# EAGLE design TIA2_1ch (EAGLE 7.5.0)
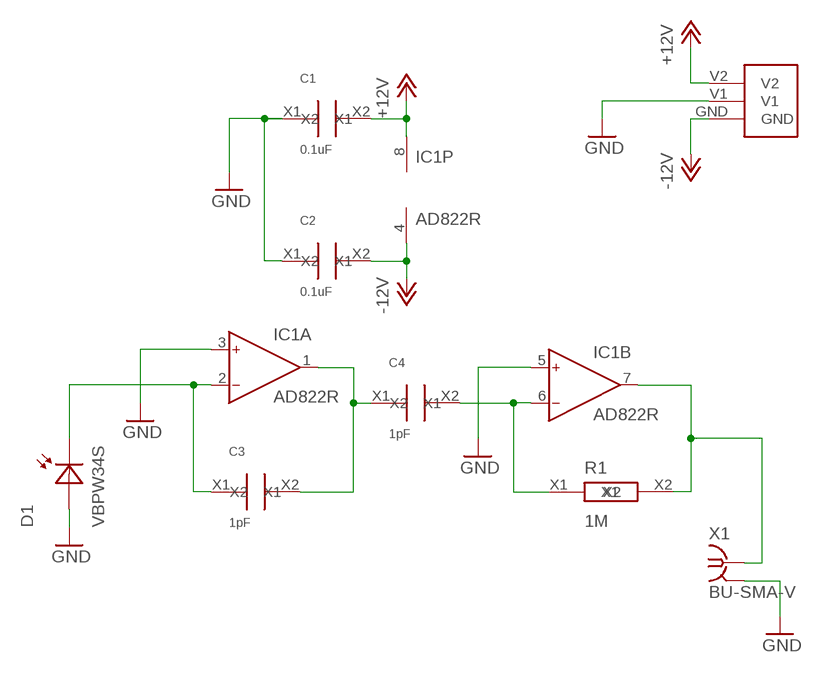
[diagram p0: schematic, sheet 1]

## Parts
C1  0.1uF  C_SMD_2.1X1.25  [SMD_2.1X1.25]
C2  0.1uF  C_SMD_2.1X1.25  [SMD_2.1X1.25]
C3  1pF  C_SMD_2.1X1.25  [SMD_2.1X1.25]
C4  1pF  C_SMD_2.1X1.25  [SMD_2.1X1.25]
D1  VBPW34S  [SOD6439X130N]
IC1  AD822R  [SO8]
R1  1M  R_SMD_2.1X1.25  [SMD_2.1X1.25]
U$1  BAT3_PLUG  [BAT3_PLUG]
X1  BU-SMA-V  [BU-SMA-V]

## Nets
+12V: C1.X2 IC1.8(P:V+) U$1.V2
-12V: C2.X2 IC1.4(P:V-) U$1.GND
GND: C1.X1 C2.X1 D1.A IC1.3(A:IN+) IC1.5(B:IN+) U$1.V1 X1.2 X1.3 X1.4 X1.5
N$1: C3.X1 D1.C IC1.2(A:IN-)
N$2: C3.X2 C4.X1 IC1.1(A:OUT)
N$3: C4.X2 IC1.6(B:IN-) R1.X1
N$4: IC1.7(B:OUT) R1.X2 X1.1

## Library data of the parts
C1-C4 = MyPowerComponents:C_SMD_2.1X1.25
D1 = VBPW34S:VBPW34S: VBPW34SR Series 60 V 940 nm 50 mA 215 mW Surface Mount Silicon PIN Photodiode; DESCRIPTION: VBPW34SR Series 60 V 940 nm 50 mA 215 mW Surface Mount Silicon PIN Photodiode; DIGI-KEY_PART_NUMBER: 751-1500-1-ND; DIGI-KEY_PURCHASE_URL: https://www.digikey.ru/product-detail/en/vishay-semiconductor-opto-division/VBPW34S/751-1500-1-ND/2354866?utm_source=snapeda&utm_medium=aggregator&utm_campaign=symbol; MF: Vishay; MP: VBPW34S; PACKAGE: SMD-2 Vishay
IC1 = analog-devices:AD822: Single-Supply, Rail-to-Rail Low Power FET-Input Op Amp Source: http://www.analog.com/static/imported-files/data_sheets/AD822.pdf; MF: ANALOG DEVICES; MPN: AD822BRZ; OC_FARNELL: 1651303
R1 = MyPowerComponents:R_SMD_2.1X1.25
U$1 = MyDuino:BAT3_PLUG
X1 = con-coax:BU-SMA-V: FEMALE SMA CONNECTOR Radiall distributor RS 112-3794; OC_FARNELL: unknown; OC_NEWARK: unknown

## Board
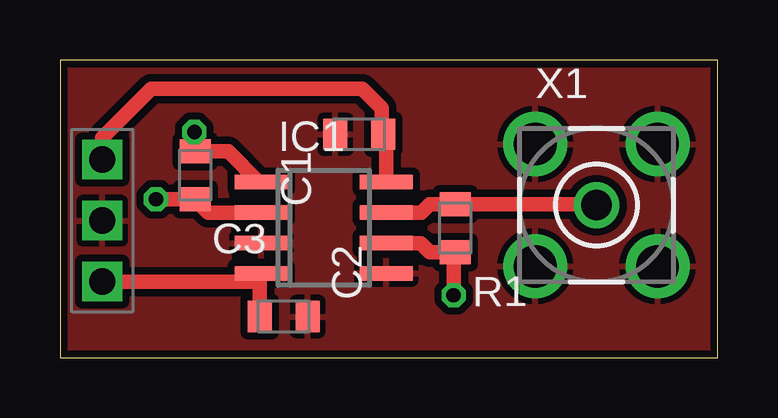
[diagram p1: board, top side]
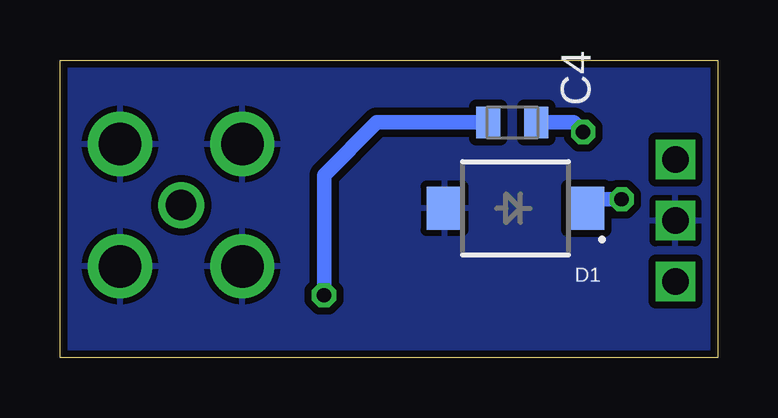
[diagram p2: board, bottom side, seen from below]

Size 27.4 x 12.4 mm. Coordinates in mm from the lower left corner, seen from the top.
Outline: 0,0 27.4,0 27.4,12.4 0,12.4 0,0
Copper layers (1*16): Top 0.035mm / dielectric 1.5mm / Bottom 0.035mm
Design rules "default *": minimum track width 10mil, minimum drill 24mil, track to track 8mil, track to pad 8mil, pad to pad 8mil, via to via 8mil, smd to smd 8mil, copper to edge 10mil, drill to drill 8mil, minimum pad ring 10mil, minimum via ring 8mil, stop-mask expansion 4mil, vias tented up to drill 0mil, thermal gap 10mil

### Footprints (pad centres in the part's own frame; a part is rotated, then mirrored left to right if it is on the bottom)
SMD_2.1X1.25 = smd 1.3 x 1: X1 0,1; X2 0,-1
SOD6439X130N = smd 1.5 x 1.8: A 2.95,0; C -2.95,0
SO8 = smd 0.6 x 2.2: 1 -1.905,-2.6; 2 -0.635,-2.6; 3 0.635,-2.6; 4 1.905,-2.6; 5 1.905,2.6; 6 0.635,2.6; 7 -0.635,2.6; 8 -1.905,2.6
BAT3_PLUG = drill 1.1 square: GND 0,-2.54; V1 0,0; V2 0,2.54
BU-SMA-V = drill 1.27: 1 0,0 | drill 1.778: 2 -2.55,2.55; 3 2.55,2.55; 4 2.55,-2.55; 5 -2.55,-2.55

### Placement (x,y rotation side)
C1  12.47,9.31 90 top
C2  9.32,1.71 270 top
C3  5.63,7.6 180 top
C4  8.55,9.8 270 bottom
D1  8.42,6.22 180 bottom
IC1  10.99,5.41 270 top
R1  16.47,5.4 180 top
U$1  1.76,5.71 0 top
X1  22.35,6.35 0 top

### Tracks (layer width: path | path; a pad name or v marks a point on that pad's centre or on a via)
+12V
  Top 0.61: U$1.V2 1.76,9.16 3.8,11.2 12.6,11.2 13.4,10.4 13.4,9.38 C1.X2 13.59,9.19 IC1.8
-12V
  Top 0.61: C2.X2 8.32,3.44 IC1.4 8.05,3.17 U$1.GND
GND
  pour Bottom (isolate 0.305): 0,0 27.4,0 27.4,12.4 0,12.4
  pour Top (isolate 0.305): 0,0 27.4,0 27.4,12.4 0,12.4
N$1  (via drill 0.6)
  Top 0.61: IC1.2 6.18,6.04 C3.X1 v4,6.6
  Bottom 0.61: v4,6.6 5.09,6.6 D1.C
N$2  (via drill 0.6)
  Top 0.61: IC1.1 8.29,7.32 7,8.6 C3.X2 5.6,8.63 v5.6,9.4
  Bottom 0.61: C4.X1 6,9.8 v5.6,9.4
N$3  (via drill 0.6)
  Top 0.61: v16.4,2.6 16.4,4.33 R1.X1 15.4,4.4 15.03,4.78 IC1.6
  Bottom 0.61: C4.X2 14.2,9.8 16.4,7.6 v16.4,2.6
N$4
  Top 0.61: IC1.7 15.04,6.04 15.4,6.4 R1.X2 22.3,6.4 X1.1